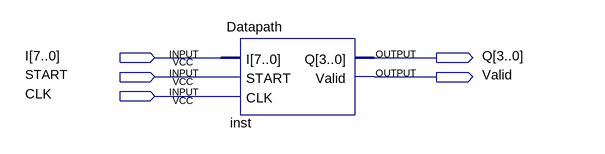
[diagram p0: schematic sheet]
// Quartus schematic counterbit1.bdf as structural Verilog: 1 symbols, 5 pins
module counterbit1 (
  input  [7:0] I,
  input  START,
  input  CLK,
  output [3:0] Q,
  output Valid
);

  Datapath inst (.I(I), .START(START), .CLK(CLK), .Q(Q), .Valid(Valid));
endmodule
